# Altium schematic sheet Power.SchDoc
size A4; Organization: Altium Limited; Address1: L3, 12a Rodborough Rd; Address2: Frenchs Forest; Address3: NSW; Address4: Australia 2086
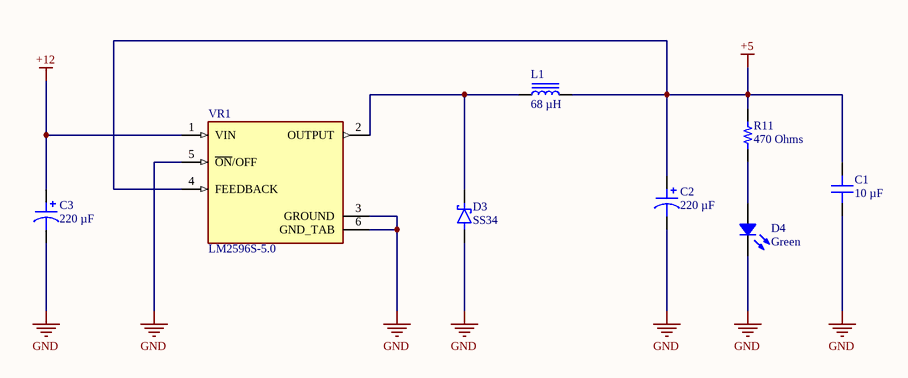
[diagram p0: Power.SchDoc]

## Parts
C1  10 µF  [CAP 0603_1608]
C2  220 µF  [CAP ALSMD 8.3MM H10.5MM]
C3  220 µF  [CAP ALSMD 8.3MM H10.5MM]
D3  SS34  [DIOM7959X265N]
D4  Green  [LED 0402_1005 GREEN]
L1  68 µH  [WURTH WE-PD 1210]
R11  470 Ohms  [RES 0603_1608]
VR1  LM2596S-5.0  [TO170P1524X483-6N]

## Nets
+5: C1.2 C2.1 L1.2 R11.2 VR1.4(FEEDBACK)
+12: C3.1 VR1.1(VIN)
GND: C1.1 C2.2 C3.2 D3.A D4.2 VR1.3(GROUND) VR1.5(~{ON}/OFF) VR1.6(GND_TAB)
NetD3_C: D3.C(K) L1.1 VR1.2(OUTPUT)
NetD4_1: D4.1 R11.1

## Notes on the sheet
- Title
- Size:
- Date:
- A4
- Number:
- Time:
- Revision:
- Sheet
- of
- File:

## Library data of the parts
C1 = TMK107BBJ106MA-T: CAP CER 10UF 25V X5R 0603; manufacturer: Taiyo Yuden; Tolerance: ±20%; Part Number: TMK107BBJ106MA-T; Value: 10 µF; Applications: SMPS Filtering; Capacitance: 10 µF; componentlink1description: Datasheet; componentlink1url: https://ds.yuden.co.jp/TYCOMPAS/ut/detail?pn=TMK107BBJ106MA-T &u=M; componentlink2description: DigiKey Link; componentlink2url: https://www.digikey.com/en/products/detail/taiyo-yuden/TMK107BBJ106MA-T/7403921; Device Package: 0603 (1608 Metric); lastupdated: 2/9/2024 8:10:22 PM; Lifecycle Status: Active; Minimum Order: 1; Mounting Type: Surface Mount, MLCC; Operating Temperature: -55°C ~ 85°C; Package / Case: 0603 (1608 Metric); packaging: TapeAndReel; partid: 8967; Part Status: Active; price: 0.07; series: M; Size / Dimension: 0.063" L x 0.031" W (1.60mm x 0.80mm); Supplier 1: DigiKey; Supplier Part Number 1: 587-6023-1-ND; Temperature Coefficient: X5R; Thickness (Max): 0.039" (1.00mm); Voltage - Rated: 25V
C2 C3 = VZH221M1ETR-0810S: CAP ALUM 220UF 20% 25V SMD; manufacturer: SURGE; Impedance: 170 mOhms; Lifetime @ Temp.: 5000 Hrs @ 105°C; Polarization: Polar; Ripple Current @ High Frequency: 450 mA @ 100 kHz; Surface Mount Land Size: 0.327" L x 0.327" W (8.30mm x 8.30mm); Part Number: VZH221M1ETR-0810S; Applications: General Purpose; Capacitance: 220 µF; componentlink1description: Datasheet; componentlink1url: https://www.surgecomponents.com/pdf/VZH.pdf; componentlink2description: DigiKey Link; componentlink2url: https://www.digikey.com/en/products/detail/surge/VZH221M1ETR-0810S/12451632; Height - Seated (Max): 0.413" (10.50mm); lastupdated: 6/3/2024 8:15:42 PM; Lifecycle Status: Active; Minimum Order: 1; Mounting Type: Surface Mount; Operating Temperature: -55°C ~ 105°C; packaging: CutTape; partid: 28093; Part Status: Active; price: 0.25; series: VZH; Size / Dimension: 0.315" Dia (8.00mm); Supplier 1: DigiKey; Supplier Part Number 1: 4403-VZH221M1ETR-0810SCT-ND; Tolerance: ±20%; value: 220 µF; Voltage - Rated: 25 V
D3 = SS34: Diode Schottky 40 V 3A Surface Mount SMC (DO-214AB); MF: onsemi; SnapEDA_Link: https://www.snapeda.com/parts/SS34/Onsemi/view-part/?ref=snap; Package: SMC-2 ON Semiconductor; Value: *; MP: SS34; Check_prices: https://www.snapeda.com/parts/SS34/Onsemi/view-part/?ref=eda
D4 = XZVGR68W-3: LED GREEN CLEAR 0402 SMD; Manufacturer: SunLED; Configuration: Standard; Current - Test: 20mA; Lens Color: Colorless; Lens Size: 0.60mm x 0.50mm; Lens Style: Rectangle with Flat Top; Millicandela Rating: 34mcd; Viewing Angle: 120°; Voltage - Forward (Vf) (Typ): 2V; Wavelength - Dominant: 571nm; Wavelength - Peak: 572nm; Part Number: XZVGR68W-3; Color: Green; ComponentLink1Description: Datasheet; ComponentLink1URL: https://www.sunledusa.com/products/spec/XZVGR68W-3.pdf; ComponentLink2Description: DigiKey Link; ComponentLink2URL: https://www.digikey.com/en/products/detail/sunled/XZVGR68W-3/6615530; Device Package: 0402 (1005 Metric); Height (Max): 0.25mm; LastUpdated: 6/3/2024 7:58:14 PM; Lens Transparency: Clear; Lifecycle Status: Active; Minimum Order: 1; Mounting Type: Surface Mount; Package / Case: 0402 (1005 Metric); Packaging: TapeAndReel; PartId: 718; Part Status: Active; Price: 0.08; Series: -; Size / Dimension: 1.00mm L x 0.50mm W; Supplier 1: DigiKey; Supplier Part Number 1: 1497-1386-1-ND; Supplier Device Package: 0402; Value: Green
L1 = 7447709680: FIXED IND 68UH 3.2A 89 MOHM SMD; Manufacturer: Würth Elektronik; Current - Saturation: 3.6A; DC Resistance (DCR): 89mOhm Max; Frequency - Self Resonant: 5.5MHz; Inductance Frequency - Test: 1 kHz; Material - Core: Ferrite; Shielding: Shielded; Tolerance: ±20%; Type: Drum Core, Wirewound; Part Number: 7447709680; ComponentLink1Description: Datasheet; ComponentLink1URL: https://katalog.we-online.de/pbs/datasheet/7447709680.pdf; ComponentLink2Description: DigiKey Link; ComponentLink2URL: https://www.digikey.com/en/products/detail/würth-elektronik/7447709680/1638652; Current Rating (Amps): 3.2 A; Device Package: Nonstandard; Height - Seated (Max): 0.394" (10.00mm); Inductance: 68 µH; LastUpdated: 6/3/2024 8:26:17 PM; Lifecycle Status: Active; Minimum Order: 1; Mounting Type: Surface Mount; Operating Temperature: -40°C ~ 125°C; Package / Case: Nonstandard; Packaging: TapeAndReel; PartId: 5691; Part Status: Active; Price: 1.48; Ratings: AEC-Q200; Series: WE-PD; Size / Dimension: 0.472" L x 0.472" W (12.00mm x 12.00mm); Supplier 1: DigiKey; Supplier Part Number 1: 732-1247-1-ND; Supplier Device Package: 1212; Value: 68 µH
R11 = RN73R1JTTD4700B25: RES 470 OHM 0.1% 1/10W 0603; Manufacturer: KOA Speer Electronics, Inc.; Power (Watts): 0.1W, 1/10W; Temperature Coefficient: ±25ppm/°C; Part Number: RN73R1JTTD4700B25; Value: 470 Ohms; ComponentLink1Description: Datasheet; ComponentLink1URL: https://media.digikey.com/pdf/Data%20Sheets/KOA%20Speer/RN73R_Type_DS.pdf; ComponentLink2Description: DigiKey Link; ComponentLink2URL: https://www.digikey.com/en/products/detail/koa-speer-electronics-inc/RN73R1JTTD4700B25/10017891; Composition: Thin Film; Device Package: 0603 (1608 Metric); Features: Automotive AEC-Q200, Moisture Resistant; Height - Seated (Max): 0.022" (0.55mm); LastUpdated: 2/9/2024 8:40:55 PM; Lifecycle Status: Active; Minimum Order: 1; Number of Terminations: 2; Operating Temperature: -55°C ~ 155°C; Package / Case: 0603 (1608 Metric); Packaging: TapeAndReel; PartId: 71186; Part Status: Active; Price: 0.05; Ratings: AEC-Q200; Resistance: 470 Ohms; Series: RN73R; Size / Dimension: 0.063" L x 0.031" W (1.60mm x 0.80mm); Supplier 1: DigiKey; Supplier Part Number 1: 2019-RN73R1JTTD4700B25CT-ND; Supplier Device Package: 0603; Tolerance: ±0.1%
VR1 = LM2596S-5.0: SIMPLE SWITCHER&reg; 4.5V to 40V, 3A Low Component Count Step-Down Regulator; MP: LM2596S-5.0/NOPB; MF: Texas Instruments; Price: None; Availability: In Stock; Package: TO-263-5 Texas Instruments; SnapEDA_Link: https://www.snapeda.com/parts/LM2596S-5.0/NOPB/Texas+Instruments/view-part/?ref=snap; Check_prices: https://www.snapeda.com/parts/LM2596S-5.0/NOPB/Texas+Instruments/view-part/?ref=eda; Value: *; Purchase-URL: https://pricing.snapeda.com/search/part/LM2596S-5.0/NOPB/?ref=eda